# Altium schematic sheet main2.SchDoc
size 209 x 148 mm
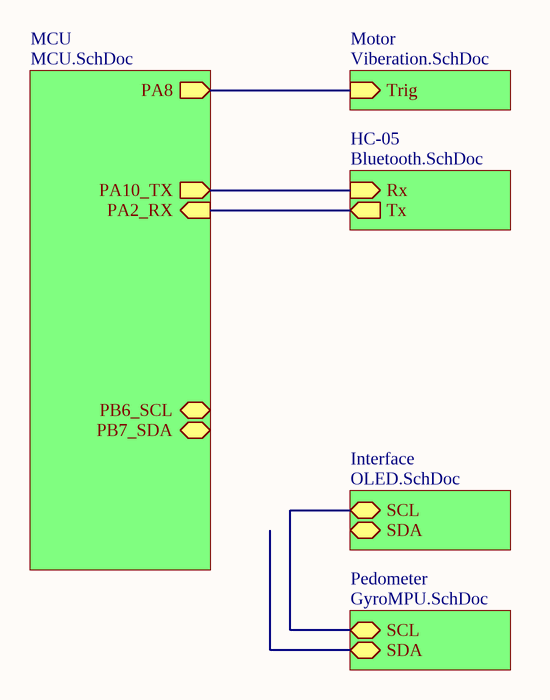
[diagram p0: main2.SchDoc]

## Sub-sheets
HC-05 = Bluetooth.SchDoc: Rx (in), Tx (out)
Interface = OLED.SchDoc: SCL (bidir), SDA (bidir)
MCU = MCU.SchDoc: PA10_TX (out), PA8 (out), PA2_RX (in), PB7_SDA (bidir), PB6_SCL (bidir)
Motor = Viberation.SchDoc: Trig (in)
Pedometer = GyroMPU.SchDoc: SDA (bidir), SCL (bidir)

## Nets
(unnamed): sheet MCU/PA10_TX, sheet HC-05/Rx
(unnamed): sheet MCU/PA8, sheet Motor/Trig
(unnamed): sheet MCU/PA2_RX, sheet HC-05/Tx
(unnamed): sheet Interface/SCL, sheet Pedometer/SCL